# Altium schematic sheet 06_ZYNQ_CAMERALINK.SchDoc
size 420 x 297 mm; SheetNumber: 6; SheetTotal: 7
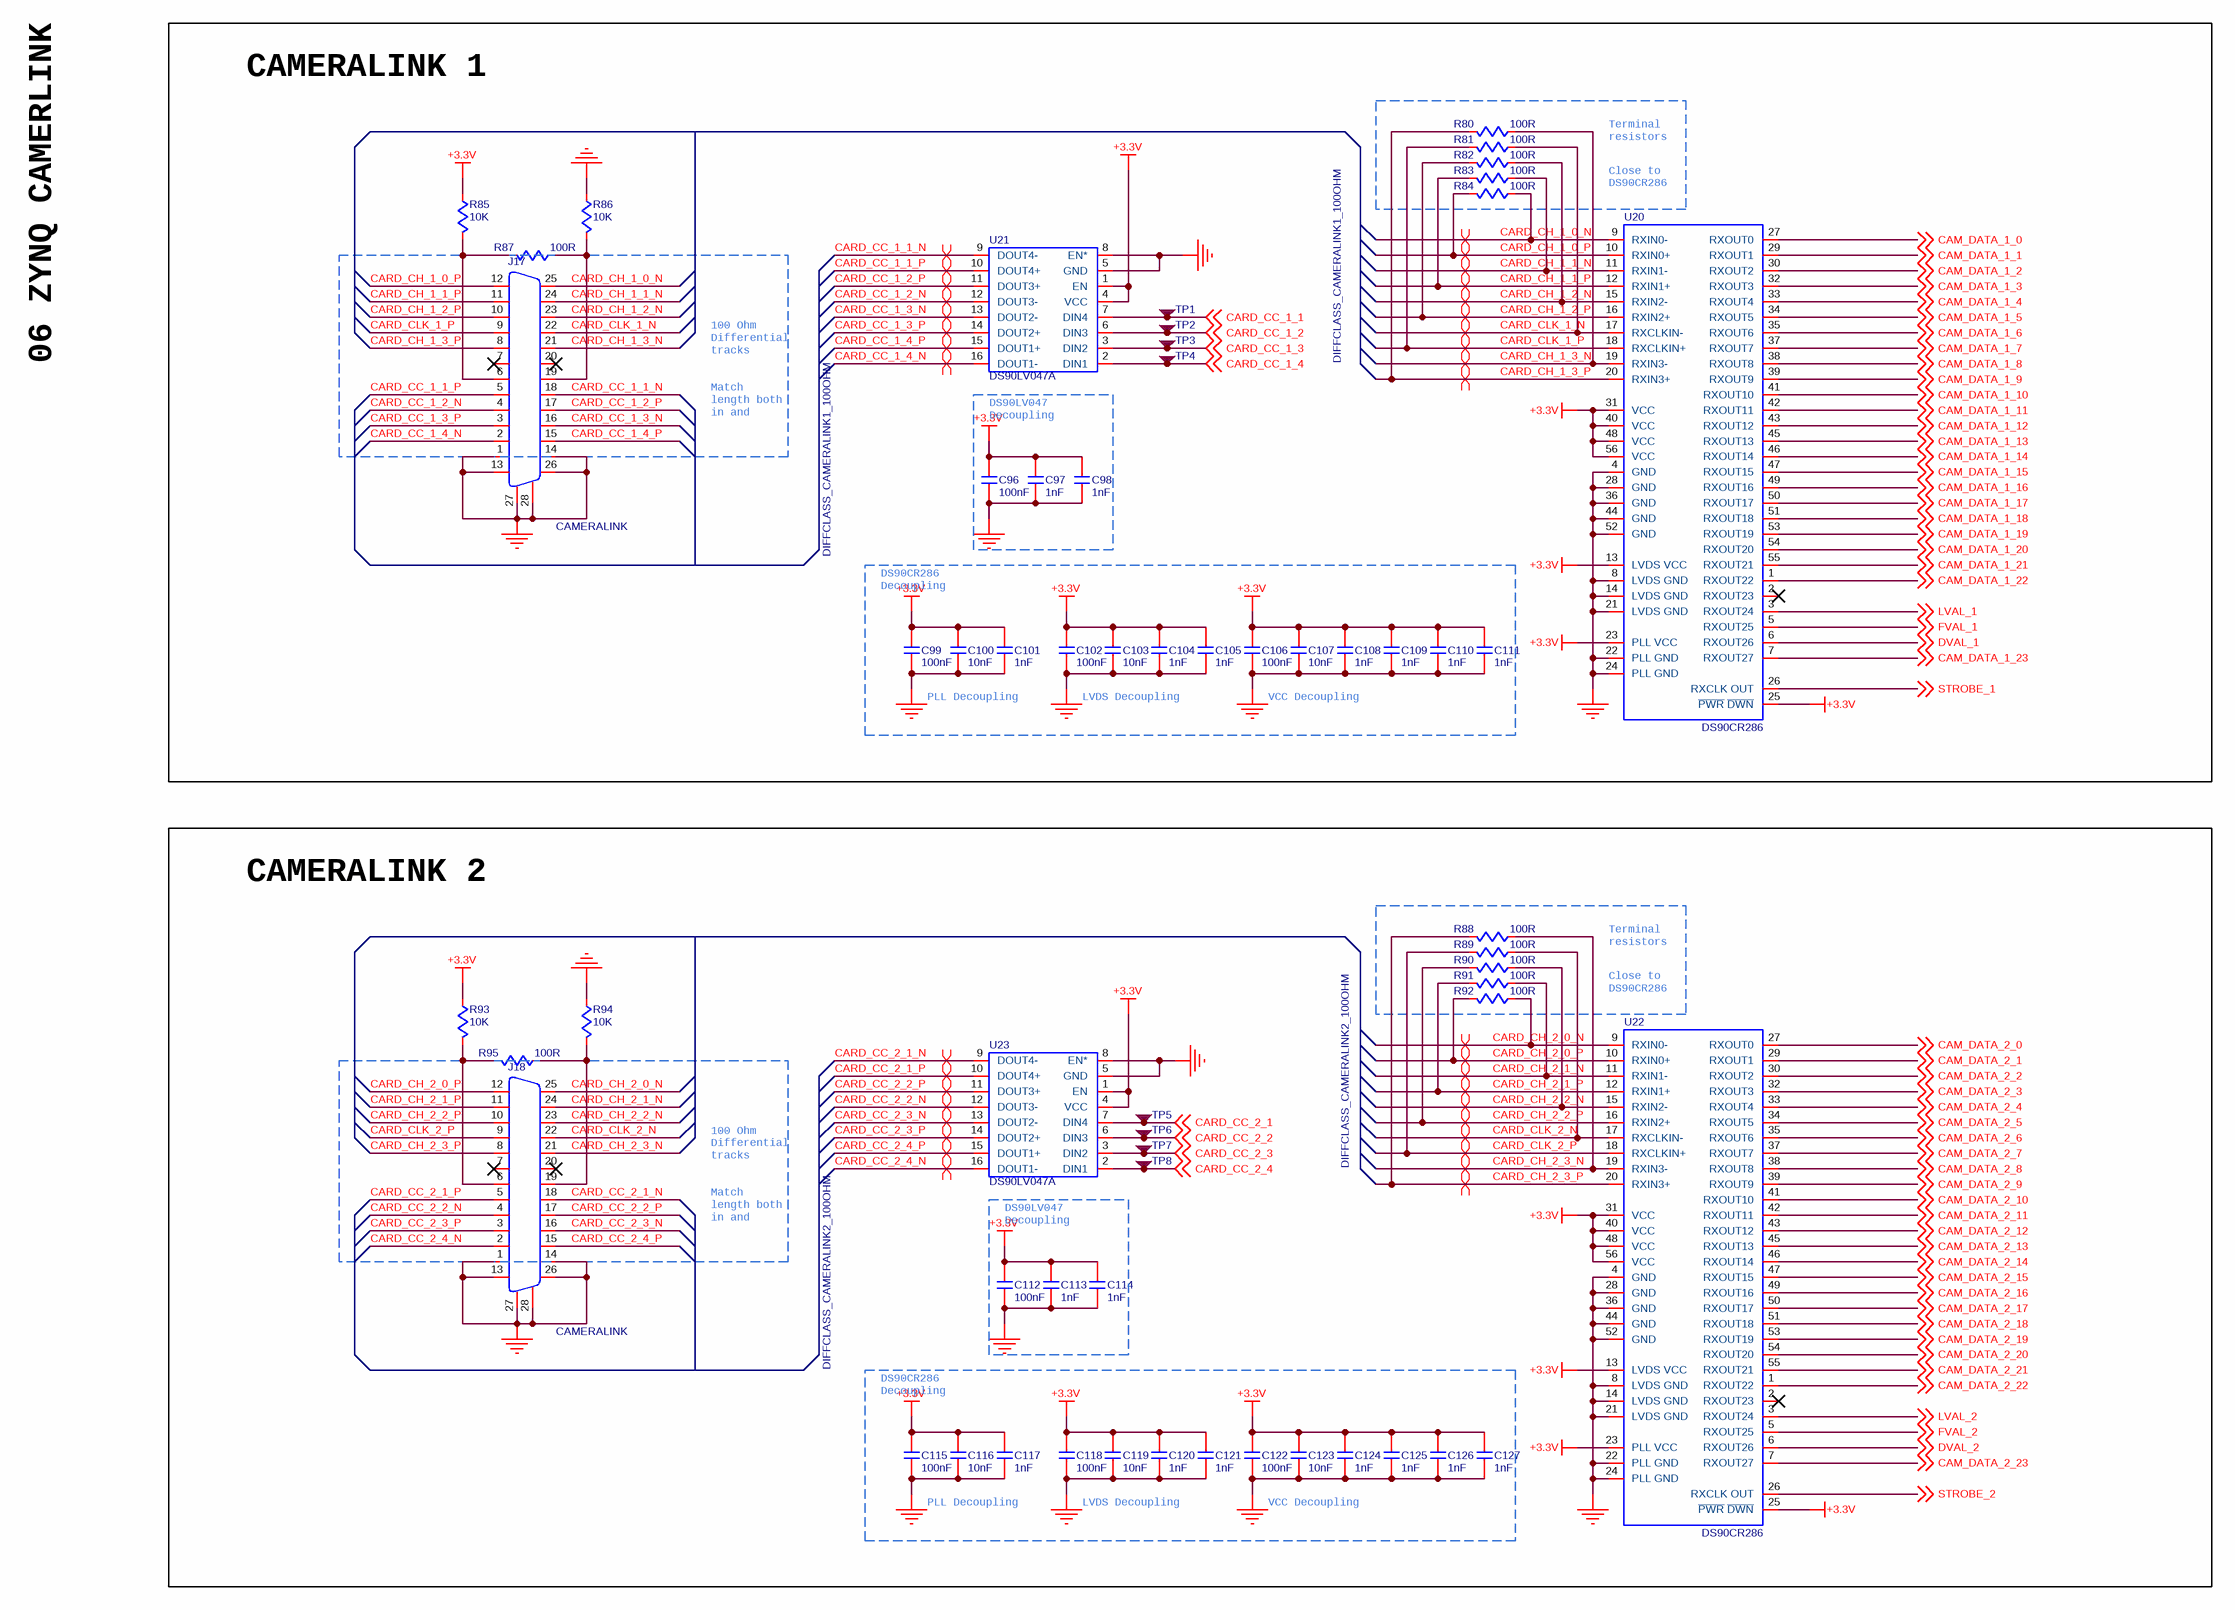
[diagram p0: 06_ZYNQ_CAMERALINK.SchDoc]

## Parts
C96  value 100nF  [C0402]  (hidden comment: C-NOMO)
C97  value 1nF  [C0402]  (hidden comment: C-NOMO)
C98  value 1nF  [C0402]  (hidden comment: C-NOMO)
C99  value 100nF  [C0402]  (hidden comment: C-NOMO)
C100  value 10nF  [C0402]  (hidden comment: C-NOMO)
C101  value 1nF  [C0402]  (hidden comment: C-NOMO)
C102  value 100nF  [C0402]  (hidden comment: C-NOMO)
C103  value 10nF  [C0402]  (hidden comment: C-NOMO)
C104  value 1nF  [C0402]  (hidden comment: C-NOMO)
C105  value 1nF  [C0402]  (hidden comment: C-NOMO)
C106  value 100nF  [C0402]  (hidden comment: C-NOMO)
C107  value 10nF  [C0402]  (hidden comment: C-NOMO)
C108  value 1nF  [C0402]  (hidden comment: C-NOMO)
C109  value 1nF  [C0402]  (hidden comment: C-NOMO)
C110  value 1nF  [C0402]  (hidden comment: C-NOMO)
C111  value 1nF  [C0402]  (hidden comment: C-NOMO)
C112  value 100nF  [C0402]  (hidden comment: C-NOMO)
C113  value 1nF  [C0402]  (hidden comment: C-NOMO)
C114  value 1nF  [C0402]  (hidden comment: C-NOMO)
C115  value 100nF  [C0402]  (hidden comment: C-NOMO)
C116  value 10nF  [C0402]  (hidden comment: C-NOMO)
C117  value 1nF  [C0402]  (hidden comment: C-NOMO)
C118  value 100nF  [C0402]  (hidden comment: C-NOMO)
C119  value 10nF  [C0402]  (hidden comment: C-NOMO)
C120  value 1nF  [C0402]  (hidden comment: C-NOMO)
C121  value 1nF  [C0402]  (hidden comment: C-NOMO)
C122  value 100nF  [C0402]  (hidden comment: C-NOMO)
C123  value 10nF  [C0402]  (hidden comment: C-NOMO)
C124  value 1nF  [C0402]  (hidden comment: C-NOMO)
C125  value 1nF  [C0402]  (hidden comment: C-NOMO)
C126  value 1nF  [C0402]  (hidden comment: C-NOMO)
C127  value 1nF  [C0402]  (hidden comment: C-NOMO)
J17  CAMERALINK  [CAMERALINK]
J18  CAMERALINK  [CAMERALINK]
R80  value 100R  [R0402]  (hidden comment: R)
R81  value 100R  [R0402]  (hidden comment: R)
R82  value 100R  [R0402]  (hidden comment: R)
R83  value 100R  [R0402]  (hidden comment: R)
R84  value 100R  [R0402]  (hidden comment: R)
R85  value 10K  [R0402]  (hidden comment: R)
R86  value 10K  [R0402]  (hidden comment: R)
R87  value 100R  [R0402]  (hidden comment: R)
R88  value 100R  [R0402]  (hidden comment: R)
R89  value 100R  [R0402]  (hidden comment: R)
R90  value 100R  [R0402]  (hidden comment: R)
R91  value 100R  [R0402]  (hidden comment: R)
R92  value 100R  [R0402]  (hidden comment: R)
R93  value 10K  [R0402]  (hidden comment: R)
R94  value 10K  [R0402]  (hidden comment: R)
R95  value 100R  [R0402]  (hidden comment: R)
TP1  TP  [TP]  (value not drawn)
TP2  TP  [TP]  (value not drawn)
TP3  TP  [TP]  (value not drawn)
TP4  TP  [TP]  (value not drawn)
TP5  TP  [TP]  (value not drawn)
TP6  TP  [TP]  (value not drawn)
TP7  TP  [TP]  (value not drawn)
TP8  TP  [TP]  (value not drawn)
U20  DS90CR286  [DS90CR286]
U21  DS90LV047A  [DS90LV047]
U22  DS90CR286  [DS90CR286]
U23  DS90LV047A  [DS90LV047]

## Blocks framed on the sheet
CAMERALINK 1: C96-C111 J17 R80-R87 TP1-TP4 U20 U21
CAMERALINK 2: C112-C127 J18 R88-R95 TP5-TP8 U22 U23

## Nets
+3.3V: C96.2 C97.2 C98.2 C99.2 C100.2 C101.2 C102.2 C103.2 C104.2 C105.2 C106.2 C107.2 C108.2 C109.2 C110.2 C111.2 C112.2 C113.2 C114.2 C115.2 C116.2 C117.2 C118.2 C119.2 C120.2 C121.2 C122.2 C123.2 C124.2 C125.2 C126.2 C127.2 R85.2 R93.2 U20.13(LVDS_VCC) U20.23(PLL_VCC) U20.25(~{PWR}_~{DWN}) U20.31(VCC) U20.40(VCC) U20.48(VCC) U20.56(VCC) U21.1(EN) U21.4(VCC) U22.13(LVDS_VCC) U22.23(PLL_VCC) U22.25(~{PWR}_~{DWN}) U22.31(VCC) U22.40(VCC) U22.48(VCC) U22.56(VCC) U23.1(EN) U23.4(VCC)
GND: C96.1 C97.1 C98.1 C99.1 C100.1 C101.1 C102.1 C103.1 C104.1 C105.1 C106.1 C107.1 C108.1 C109.1 C110.1 C111.1 C112.1 C113.1 C114.1 C115.1 C116.1 C117.1 C118.1 C119.1 C120.1 C121.1 C122.1 C123.1 C124.1 C125.1 C126.1 C127.1 J17.1 J17.13 J17.14 J17.26 J17.27 J17.28 J18.1 J18.13 J18.14 J18.26 J18.27 J18.28 R86.2 R94.2 U20.4(GND) U20.8(LVDS_GND) U20.14(LVDS_GND) U20.21(LVDS_GND) U20.22(PLL_GND) U20.24(PLL_GND) U20.28(GND) U20.36(GND) U20.44(GND) U20.52(GND) U21.5(GND) U21.8(EN*) U22.4(GND) U22.8(LVDS_GND) U22.14(LVDS_GND) U22.21(LVDS_GND) U22.22(PLL_GND) U22.24(PLL_GND) U22.28(GND) U22.36(GND) U22.44(GND) U22.52(GND) U23.5(GND) U23.8(EN*)
CAM_DATA_1_0: U20.27(RXOUT0) ; off-sheet CAM_DATA_1_0
CAM_DATA_1_1: U20.29(RXOUT1) ; off-sheet CAM_DATA_1_1
CAM_DATA_1_2: U20.30(RXOUT2) ; off-sheet CAM_DATA_1_2
CAM_DATA_1_3: U20.32(RXOUT3) ; off-sheet CAM_DATA_1_3
CAM_DATA_1_4: U20.33(RXOUT4) ; off-sheet CAM_DATA_1_4
CAM_DATA_1_5: U20.34(RXOUT5) ; off-sheet CAM_DATA_1_5
CAM_DATA_1_6: U20.35(RXOUT6) ; off-sheet CAM_DATA_1_6
CAM_DATA_1_7: U20.37(RXOUT7) ; off-sheet CAM_DATA_1_7
CAM_DATA_1_8: U20.38(RXOUT8) ; off-sheet CAM_DATA_1_8
CAM_DATA_1_9: U20.39(RXOUT9) ; off-sheet CAM_DATA_1_9
CAM_DATA_1_10: U20.41(RXOUT10) ; off-sheet CAM_DATA_1_10
CAM_DATA_1_11: U20.42(RXOUT11) ; off-sheet CAM_DATA_1_11
CAM_DATA_1_12: U20.43(RXOUT12) ; off-sheet CAM_DATA_1_12
CAM_DATA_1_13: U20.45(RXOUT13) ; off-sheet CAM_DATA_1_13
CAM_DATA_1_14: U20.46(RXOUT14) ; off-sheet CAM_DATA_1_14
CAM_DATA_1_15: U20.47(RXOUT15) ; off-sheet CAM_DATA_1_15
CAM_DATA_1_16: U20.49(RXOUT16) ; off-sheet CAM_DATA_1_16
CAM_DATA_1_17: U20.50(RXOUT17) ; off-sheet CAM_DATA_1_17
CAM_DATA_1_18: U20.51(RXOUT18) ; off-sheet CAM_DATA_1_18
CAM_DATA_1_19: U20.53(RXOUT19) ; off-sheet CAM_DATA_1_19
CAM_DATA_1_20: U20.54(RXOUT20) ; off-sheet CAM_DATA_1_20
CAM_DATA_1_21: U20.55(RXOUT21) ; off-sheet CAM_DATA_1_21
CAM_DATA_1_22: U20.1(RXOUT22) ; off-sheet CAM_DATA_1_22
CAM_DATA_1_23: U20.7(RXOUT27) ; off-sheet CAM_DATA_1_23
CAM_DATA_2_0: U22.27(RXOUT0) ; off-sheet CAM_DATA_2_0
CAM_DATA_2_1: U22.29(RXOUT1) ; off-sheet CAM_DATA_2_1
CAM_DATA_2_2: U22.30(RXOUT2) ; off-sheet CAM_DATA_2_2
CAM_DATA_2_3: U22.32(RXOUT3) ; off-sheet CAM_DATA_2_3
CAM_DATA_2_4: U22.33(RXOUT4) ; off-sheet CAM_DATA_2_4
CAM_DATA_2_5: U22.34(RXOUT5) ; off-sheet CAM_DATA_2_5
CAM_DATA_2_6: U22.35(RXOUT6) ; off-sheet CAM_DATA_2_6
CAM_DATA_2_7: U22.37(RXOUT7) ; off-sheet CAM_DATA_2_7
CAM_DATA_2_8: U22.38(RXOUT8) ; off-sheet CAM_DATA_2_8
CAM_DATA_2_9: U22.39(RXOUT9) ; off-sheet CAM_DATA_2_9
CAM_DATA_2_10: U22.41(RXOUT10) ; off-sheet CAM_DATA_2_10
CAM_DATA_2_11: U22.42(RXOUT11) ; off-sheet CAM_DATA_2_11
CAM_DATA_2_12: U22.43(RXOUT12) ; off-sheet CAM_DATA_2_12
CAM_DATA_2_13: U22.45(RXOUT13) ; off-sheet CAM_DATA_2_13
CAM_DATA_2_14: U22.46(RXOUT14) ; off-sheet CAM_DATA_2_14
CAM_DATA_2_15: U22.47(RXOUT15) ; off-sheet CAM_DATA_2_15
CAM_DATA_2_16: U22.49(RXOUT16) ; off-sheet CAM_DATA_2_16
CAM_DATA_2_17: U22.50(RXOUT17) ; off-sheet CAM_DATA_2_17
CAM_DATA_2_18: U22.51(RXOUT18) ; off-sheet CAM_DATA_2_18
CAM_DATA_2_19: U22.53(RXOUT19) ; off-sheet CAM_DATA_2_19
CAM_DATA_2_20: U22.54(RXOUT20) ; off-sheet CAM_DATA_2_20
CAM_DATA_2_21: U22.55(RXOUT21) ; off-sheet CAM_DATA_2_21
CAM_DATA_2_22: U22.1(RXOUT22) ; off-sheet CAM_DATA_2_22
CAM_DATA_2_23: U22.7(RXOUT27) ; off-sheet CAM_DATA_2_23
CARD_CC_1_1: TP1.0 U21.7(DIN4) ; off-sheet CARD_CC_1_1
CARD_CC_1_1_N: J17.18 U21.9(DOUT4-)
CARD_CC_1_1_P: J17.5 U21.10(DOUT4+)
CARD_CC_1_2: TP2.0 U21.6(DIN3) ; off-sheet CARD_CC_1_2
CARD_CC_1_2_N: J17.4 U21.12(DOUT3-)
CARD_CC_1_2_P: J17.17 U21.11(DOUT3+)
CARD_CC_1_3: TP3.0 U21.3(DIN2) ; off-sheet CARD_CC_1_3
CARD_CC_1_3_N: J17.16 U21.13(DOUT2-)
CARD_CC_1_3_P: J17.3 U21.14(DOUT2+)
CARD_CC_1_4: TP4.0 U21.2(DIN1) ; off-sheet CARD_CC_1_4
CARD_CC_1_4_N: J17.2 U21.16(DOUT1-)
CARD_CC_1_4_P: J17.15 U21.15(DOUT1+)
CARD_CC_2_1: TP5.0 U23.7(DIN4) ; off-sheet CARD_CC_2_1
CARD_CC_2_1_N: J18.18 U23.9(DOUT4-)
CARD_CC_2_1_P: J18.5 U23.10(DOUT4+)
CARD_CC_2_2: TP6.0 U23.6(DIN3) ; off-sheet CARD_CC_2_2
CARD_CC_2_2_N: J18.4 U23.12(DOUT3-)
CARD_CC_2_2_P: J18.17 U23.11(DOUT3+)
CARD_CC_2_3: TP7.0 U23.3(DIN2) ; off-sheet CARD_CC_2_3
CARD_CC_2_3_N: J18.16 U23.13(DOUT2-)
CARD_CC_2_3_P: J18.3 U23.14(DOUT2+)
CARD_CC_2_4: TP8.0 U23.2(DIN1) ; off-sheet CARD_CC_2_4
CARD_CC_2_4_N: J18.2 U23.16(DOUT1-)
CARD_CC_2_4_P: J18.15 U23.15(DOUT1+)
CARD_CH_1_0_N: J17.25 R84.2 U20.9(RXIN0-)
CARD_CH_1_0_P: J17.12 R84.1 U20.10(RXIN0+)
CARD_CH_1_1_N: J17.24 R83.2 U20.11(RXIN1-)
CARD_CH_1_1_P: J17.11 R83.1 U20.12(RXIN1+)
CARD_CH_1_2_N: J17.23 R82.2 U20.15(RXIN2-)
CARD_CH_1_2_P: J17.10 R82.1 U20.16(RXIN2+)
CARD_CH_1_3_N: J17.21 R80.2 U20.19(RXIN3-)
CARD_CH_1_3_P: J17.8 R80.1 U20.20(RXIN3+)
CARD_CH_2_0_N: J18.25 R92.2 U22.9(RXIN0-)
CARD_CH_2_0_P: J18.12 R92.1 U22.10(RXIN0+)
CARD_CH_2_1_N: J18.24 R91.2 U22.11(RXIN1-)
CARD_CH_2_1_P: J18.11 R91.1 U22.12(RXIN1+)
CARD_CH_2_2_N: J18.23 R90.2 U22.15(RXIN2-)
CARD_CH_2_2_P: J18.10 R90.1 U22.16(RXIN2+)
CARD_CH_2_3_N: J18.21 R88.2 U22.19(RXIN3-)
CARD_CH_2_3_P: J18.8 R88.1 U22.20(RXIN3+)
CARD_CLK_1_N: J17.22 R81.2 U20.17(RXCLKIN-)
CARD_CLK_1_P: J17.9 R81.1 U20.18(RXCLKIN+)
CARD_CLK_2_N: J18.22 R89.2 U22.17(RXCLKIN-)
CARD_CLK_2_P: J18.9 R89.1 U22.18(RXCLKIN+)
DVAL_1: U20.6(RXOUT26) ; off-sheet DVAL_1
DVAL_2: U22.6(RXOUT26) ; off-sheet DVAL_2
FVAL_1: U20.5(RXOUT25) ; off-sheet FVAL_1
FVAL_2: U22.5(RXOUT25) ; off-sheet FVAL_2
LVAL_1: U20.3(RXOUT24) ; off-sheet LVAL_1
LVAL_2: U22.3(RXOUT24) ; off-sheet LVAL_2
STROBE_1: U20.26(RXCLK_OUT) ; off-sheet STROBE_1
STROBE_2: U22.26(RXCLK_OUT) ; off-sheet STROBE_2
NetJ17_6: J17.6 R85.1 R87.1
NetJ17_19: J17.19 R86.1 R87.2
NetJ18_6: J18.6 R93.1 R95.1
NetJ18_19: J18.19 R94.1 R95.2

Not connected (* = marked no-connect by the designer): J17 7* 20*; J18 7* 20*; U20 2(RXOUT23)*; U22 2(RXOUT23)*

## Layout directives
differential pair; differential pair class DIFFCLASS_CAMERALINK1_100OHM: CARD_CC_1_1_N, CARD_CC_1_1_P, CARD_CC_1_2_N, CARD_CC_1_2_P, CARD_CC_1_3_N, CARD_CC_1_3_P, CARD_CC_1_4_N, CARD_CC_1_4_P, CARD_CH_1_0_N, CARD_CH_1_0_P, CARD_CH_1_1_N, CARD_CH_1_1_P, CARD_CH_1_2_N, CARD_CH_1_2_P, CARD_CH_1_3_N, CARD_CH_1_3_P, CARD_CLK_1_N, CARD_CLK_1_P
differential pair; differential pair class DIFFCLASS_CAMERALINK2_100OHM: CARD_CC_2_1_N, CARD_CC_2_1_P, CARD_CC_2_2_N, CARD_CC_2_2_P, CARD_CC_2_3_N, CARD_CC_2_3_P, CARD_CC_2_4_N, CARD_CC_2_4_P, CARD_CH_2_0_N, CARD_CH_2_0_P, CARD_CH_2_1_N, CARD_CH_2_1_P, CARD_CH_2_2_N, CARD_CH_2_2_P, CARD_CH_2_3_N, CARD_CH_2_3_P, CARD_CLK_2_N, CARD_CLK_2_P

## Notes on the sheet
- Terminal resistors
- (near U20) Close to DS90CR286
- 06 ZYNQ CAMERLINK
- 100 Ohm Differential tracks
  Match length both in and between pairs
- DS90LV047 Decoupling
- DS90CR286 Decoupling
- PLL Decoupling
- LVDS Decoupling
- VCC Decoupling
- (near U22) Close to DS90CR286

## Library data of the parts
C96-C127 = C-NOMO: voltage: 25V; precision: 5%
R80-R95 = R: precision: 1%